# EAGLE design LilyMini_Protosnap (EAGLE 7.4.0)
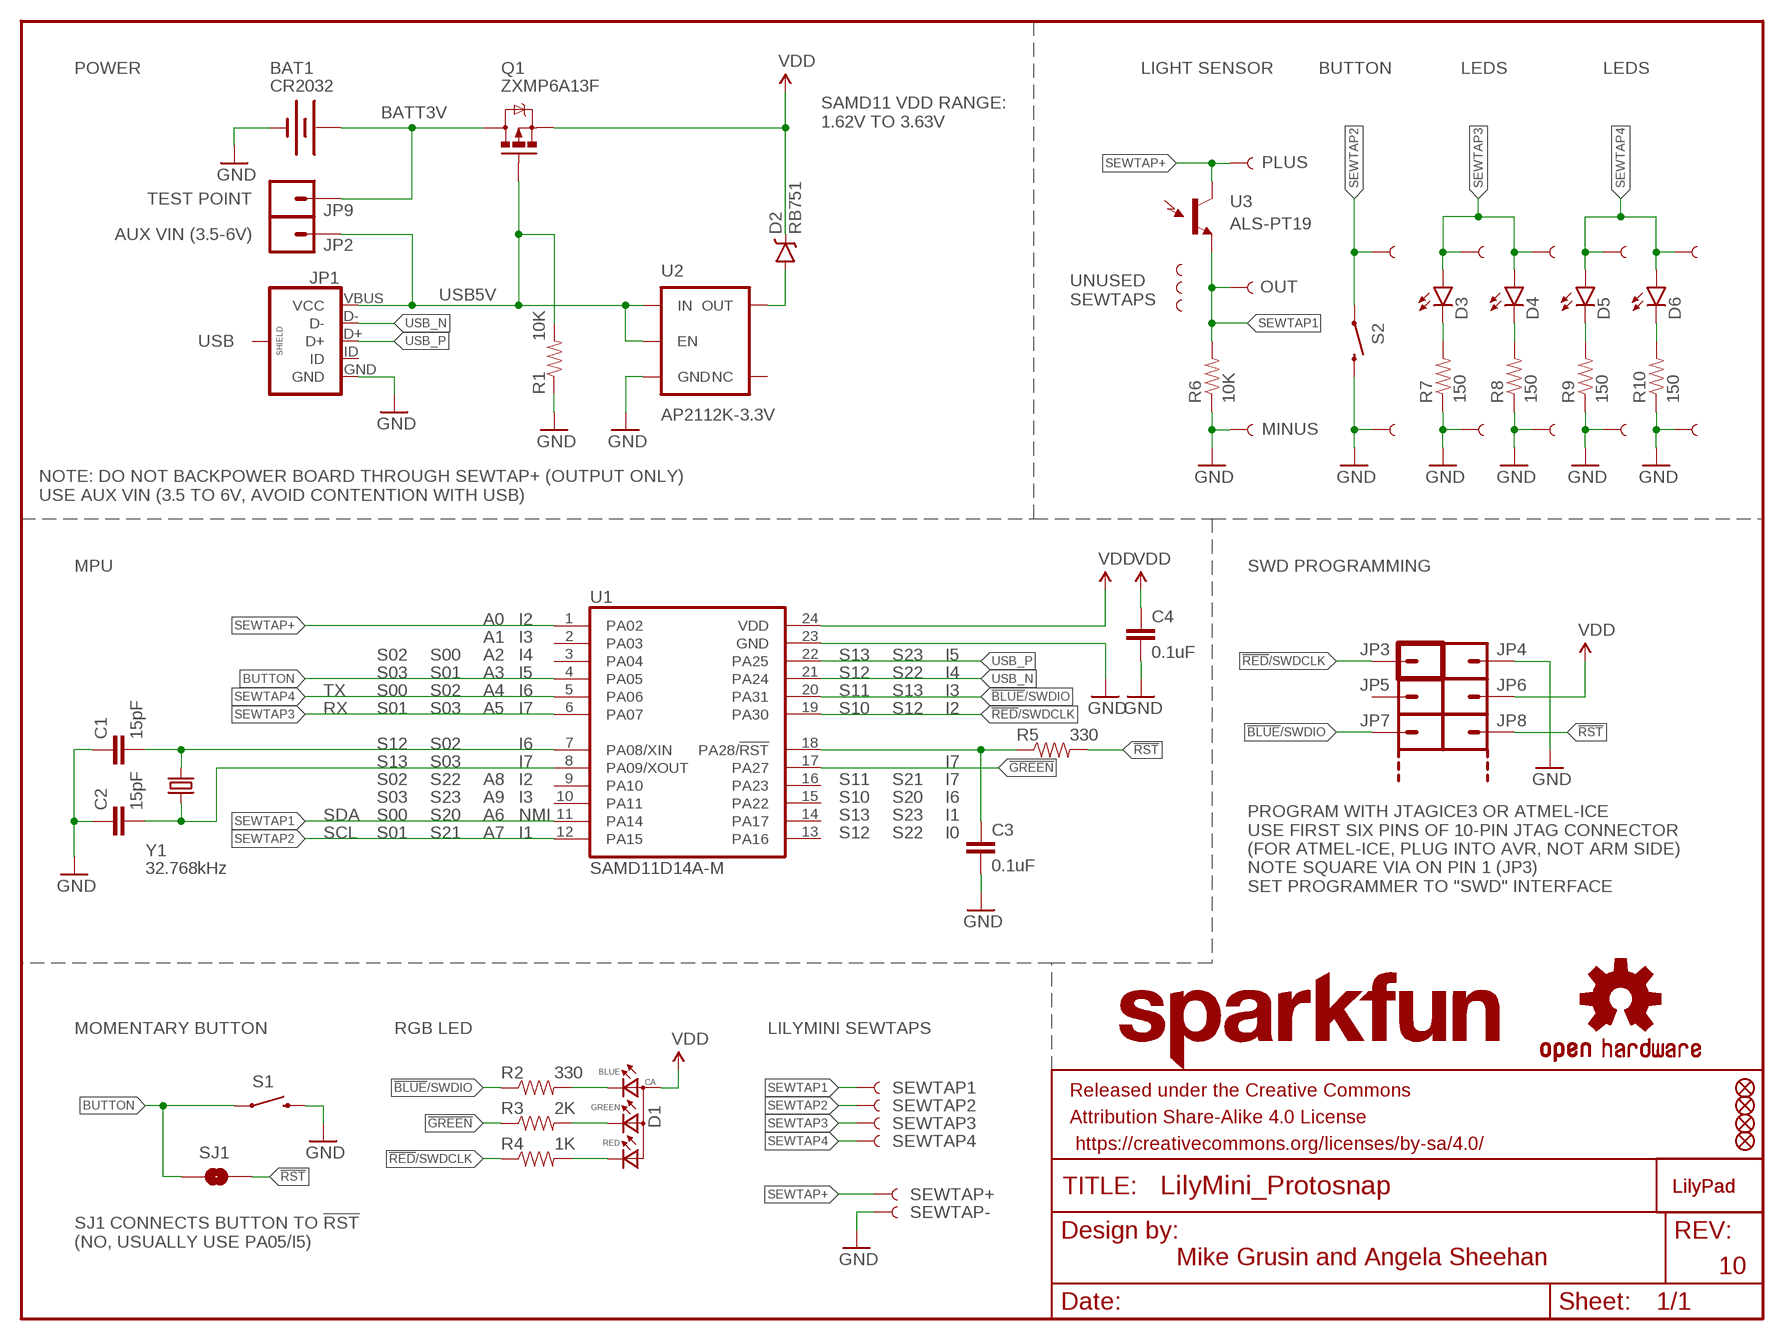
[diagram p0: schematic, sheet 1]

## Parts
$1_61_$_2016-09-25_21-56-09  OSHW-LOGOS  [OSHW-LOGO-S]
BAT1  CR2032  BATTERY20MM_PTH_KIT  [BATTERY_20MM_PTH_KIT]
C1  15pF  15PF-50V-5%(0603)  [0603-CAP]
C2  15pF  15PF-50V-5%(0603)  [0603-CAP]
C3  0.1uF  0.1UF-25V(+80/-20%)(0603)  [0603-CAP]
C4  0.1uF  0.1UF-25V(+80/-20%)(0603)  [0603-CAP]
D1  0.13_RGB_LEDPLCC  [P-LCC-4-3]
D2  RB751  DIODE-SCHOTTKY-RB751  [SOD-523]
D3  LED-WHITE1206  [LED-1206]
D4  LED-WHITE1206  [LED-1206]
D5  LED-WHITE1206  [LED-1206]
D6  LED-WHITE1206  [LED-1206]
FD1  FIDUCIAL1X2  [FIDUCIAL-1X2]
FD2  FIDUCIAL1X2  [FIDUCIAL-1X2]
FD3  FIDUCIAL1X2  [FIDUCIAL-1X2]
FD4  FIDUCIAL1X2  [FIDUCIAL-1X2]
FRAME1  FRAME-LETTER  [CREATIVE_COMMONS]
JP1  USB_MICROB_PLUGUSB-B-MICRO-SMD-VERT  [USB-B-MICRO-SMD_VERT]
JP2  M01SMDNS  [1X01NS]
JP3  M01_POGOPAD_20M_NS_1S_SQUARE  [1X01_POGOPIN_PAD_NOSILK_1SIDE_SQUARE]
JP4  M01_POGOPAD_20M_NS_1S_ROUND  [1X01_POGOPIN_PAD_NOSILK_1SIDE_ROUND]
JP5  M01_POGOPAD_20M_NS_1S_ROUND  [1X01_POGOPIN_PAD_NOSILK_1SIDE_ROUND]
JP6  M01_POGOPAD_20M_NS_1S_ROUND  [1X01_POGOPIN_PAD_NOSILK_1SIDE_ROUND]
JP7  M01_POGOPAD_20M_NS_1S_ROUND  [1X01_POGOPIN_PAD_NOSILK_1SIDE_ROUND]
JP8  M01_POGOPAD_20M_NS_1S_ROUND  [1X01_POGOPIN_PAD_NOSILK_1SIDE_ROUND]
JP9  M01_POGOPAD_20M_NS_1S_ROUND  [1X01_POGOPIN_PAD_NOSILK_1SIDE_ROUND]
JP12  SEWTAP8  [PETAL-MEDIUM-2SIDE]
JP13  SEWTAP8  [PETAL-MEDIUM-2SIDE]
JP20  SEWTAP6  [PETAL-SMALL-2SIDE]
JP21  SEWTAP6  [PETAL-SMALL-2SIDE]
JP22  SEWTAP6  [PETAL-SMALL-2SIDE]
JP23  SEWTAP6  [PETAL-SMALL-2SIDE]
JP24  SEWTAP6  [PETAL-SMALL-2SIDE]
JP25  SEWTAP6  [PETAL-SMALL-2SIDE]
JP26  SEWTAP6  [PETAL-SMALL-2SIDE]
JP27  SEWTAP6  [PETAL-SMALL-2SIDE]
LOGO1  LOGO-LPL  [LOGO-L]
LOGO2  LILYLOGO-L-TOP  [LOGO-L-TOP]
LOGO4  SFE_LOGO_NAME.1_INCH  [SFE_LOGO_NAME_.1]
Q1  ZXMP6A13F  MOSFET-PCHANNEL  [SOT23-3]
R1  10K  10KOHM-1/10W-1%(0603)0603  [0603-RES]
R2  330  330OHM1/10W1%(0603)  [0603-RES]
R3  2K  2.0KOHM1/10W5%(0603)  [0603-RES]
R4  1K  1KOHM-1/10W-1%(0603)  [0603-RES]
R5  330  330OHM1/10W1%(0603)  [0603-RES]
R6  10K  10KOHM-1/10W-1%(0603)0603  [0603-RES]
R7  150  RESISTOR0603  [0603-RES]
R8  150  RESISTOR0603  [0603-RES]
R9  150  RESISTOR0603  [0603-RES]
R10  150  RESISTOR0603  [0603-RES]
S1  SWITCH-MOMENTARY-2SMD-4.6X2.8MM  [TACTILE_SWITCH_SMD_4.6X2.8MM]
S2  SWITCH-MOMENTARY-2SMD-REDUNDANT  [TACTILE-SWITCH-SMD]
SEWTAP1  SEWTAP8  [PETAL-MEDIUM-2SIDE]
SEWTAP2  SEWTAP8  [PETAL-MEDIUM-2SIDE]
SEWTAP3  SEWTAP8  [PETAL-MEDIUM-2SIDE]
SEWTAP4  SEWTAP8  [PETAL-MEDIUM-2SIDE]
SEWTAP+  SEWTAP8  [PETAL-MEDIUM-2SIDE]
SEWTAP-  SEWTAP8  [PETAL-MEDIUM-2SIDE]
SEWTAPLS+  PLUS  SEWTAP6  [PETAL-SMALL-2SIDE]
SEWTAPLS-  MINUS  SEWTAP6  [PETAL-SMALL-2SIDE]
SEWTAPLSOUT  OUT  SEWTAP6  [PETAL-SMALL-2SIDE]
SJ1  JUMPER-PAD-2-NO  [PAD-JUMPER-2-NO_NO_SILK]
ST1  SEWTAP-NOHOLE2  [PETAL-NOHOLE-2SIDE]
ST2  SEWTAP-NOHOLE2  [PETAL-NOHOLE-2SIDE]
ST3  SEWTAP-NOHOLE2  [PETAL-NOHOLE-2SIDE]
U1  SAMD11D14A-M  [QFN-24_ALT2]
U2  AP2112K-3.3V  V_REG_AP2112K-3.3V  [SOT23-5]
U3  ALS-PT19  LIGHTSENSORALS  [ALS-PT19]
Y1  32.768kHz  CRYSTAL3.2X1.5MM  [CRYSTAL-SMD-3.2X1.5MM]

## Nets
!BLUE!/SWDIO: JP7.P$1 R2.1 U1.20(PA31)
!GREEN!: R3.1 U1.17(PA27)
!RED!/SWDCLK: JP3.P$1 R4.1 U1.19(PA30)
!RST!: JP8.P$1 R5.2 SJ1.2
!RST!1: C3.1 R5.1 U1.18(PA28/!RST!)
B: D1.3(BLUE) R2.2
BATT3V: BAT1.+1(+) BAT1.+2(+) JP9.P$1 Q1.3(D)
BUTTON: S1.1 S1.2 SJ1.1 U1.4(PA05)
G: D1.2(GREEN) R3.2
GND: BAT1.-3(-) C1.1 C2.1 C3.2 C4.2 JP1.GND JP4.P$1 JP13.1 JP21.1 JP23.1 JP25.1 JP27.1 R1.1 R6.1 R7.1 R8.1 R9.1 R10.1 S1.3 S1.4 S2.3 S2.4 SEWTAP-.1 SEWTAPLS-.1 U1.23(GND) U2.2(GND)
N$1: D2.A U2.5(OUT)
N$2: D3.C R7.2
N$3: D4.C R8.2
N$4: D5.C R9.2
N$5: D6.C R10.2
R: D1.1(RED) R4.2
SEWTAP1: R6.2 SEWTAP1.1 SEWTAPLSOUT.1 U1.11(PA14) U3.E(E1)
SEWTAP2: JP12.1 S2.1 S2.2 SEWTAP2.1 U1.12(PA15)
SEWTAP3: D3.A D4.A JP20.1 JP22.1 SEWTAP3.1 U1.6(PA07)
SEWTAP4: D5.A D6.A JP24.1 JP26.1 SEWTAP4.1 U1.5(PA06)
SEWTAP+: SEWTAP+.1 SEWTAPLS+.1 U1.1(PA02) U3.C(C1)
USB5V: JP1.VBUS(VCC) JP2.1 Q1.1(G) R1.2 U2.1(IN) U2.3(EN)
USB_N [USB]: JP1.D- U1.21(PA24)
USB_P [USB]: JP1.D+ U1.22(PA25)
VDD: C4.1 D1.4(ANODE) D2.C JP6.P$1 Q1.2(S) U1.24(VDD)
X1: C1.2 U1.7(PA08/XIN) Y1.P$2
X2: C2.2 U1.8(PA09/XOUT) Y1.P$1
Unconnected: JP1.ID JP1.P1(SHIELD) JP1.P2(SHIELD) JP1.P3(SHIELD) JP5.P$1 U1.2(PA03) U1.3(PA04) U1.9(PA10) U1.10(PA11) U1.13(PA16) U1.14(PA17) U1.15(PA22) U1.16(PA23) U2.4(NC)

## Notes on the sheet
- POWER | LIGHT SENSOR | BUTTON | LEDS | LEDS
- SAMD11 VDD RANGE:
  1.62V TO 3.63V
- TEST POINT
- AUX VIN (3.5-6V)
- UNUSED
  SEWTAPS
- USB
- NOTE: DO NOT BACKPOWER BOARD THROUGH SEWTAP+ (OUTPUT ONLY)
  USE AUX VIN (3.5 TO 6V, AVOID CONTENTION WITH USB)
- MPU | SWD PROGRAMMING
- A0 | I2
- A1 | I3
- S02 | S00 | A2 | I4 | S13 | S23 | I5
- S03 | S01 | A3 | I5 | S12 | S22 | I4
- TX | S00 | S02 | A4 | I6 | S11 | S13 | I3
- RX | S01 | S03 | A5 | I7 | S10 | S12 | I2
- S12 | S02 | I6
- S13 | S03 | I7 | I7
- S02 | S22 | A8 | I2 | S11 | S21 | I7
- S03 | S23 | A9 | I3 | S10 | S20 | I6
- SDA | S00 | S20 | A6 | NMI | S13 | S23 | I1
- SCL | S01 | S21 | A7 | I1 | S12 | S22 | I0
- PROGRAM WITH JTAGICE3 OR ATMEL-ICE
  USE FIRST SIX PINS OF 10-PIN JTAG CONNECTOR
  (FOR ATMEL-ICE, PLUG INTO AVR, NOT ARM SIDE)
  NOTE SQUARE VIA ON PIN 1 (JP3)
  SET PROGRAMMER TO "SWD" INTERFACE
- MOMENTARY BUTTON | RGB LED | LILYMINI SEWTAPS
- SJ1 CONNECTS BUTTON TO !RST!
  (NO, USUALLY USE PA05/I5)
- Mike Grusin and Angela Sheehan
- 10

## Library data of the parts
$1_61_$_2016-09-25_21-56-09 = SparkFun-Aesthetics:OSHW-LOGO: Open Source Hardware Logo This logo indicates the piece of hardware it is found on incorporates a OSHW license and/or adheres to the definition of open source hardware found here: http://freedomdefined.org/OSHW
BAT1 = mike-temp:BATTERY: Battery Holders Various common sizes : AA, AAA, 18650 (PRT-12895), 20mm coin cell and 12mm coin cell. 20MM_4LEGS, BATT-10373; PROD_ID: BATT-11519
C1 C2 = SparkFun-Capacitors:15PF-50V-5%(0603): CAP-07881; PROD_ID: CAP-07881
C3 C4 = SparkFun-Capacitors:0.1UF-25V(+80/-20%)(0603): CAP-00810 Ceramic Standard decoupling cap; PROD_ID: CAP-00810
D1 = SparkFun-LED:0.13_RGB_LED: Everlight Red/Green/Blue LED 67-23/R6GHBHC-B01/2T || 67-23/R6GHBH-B01 Size 3.2*2.8*1.9mm Mounting Type SMD Full-Color LED PLCC4 Emitting Color Red/Green/Blue (620-625/530-535/470-475 nm) Chip Material AlGaInP/InGaN/InGaN Luminous Intensity 57-112/225-450/36-72 mcd Viewing Angle 120 deg Lens Type-Color Water Clear Forward Voltage 2.0/3.5/3.5 V Forward Current 10 mA Maximum Forward Voltage 2.4/3.9/3.9 V Maximum Forward Current 25/25/25 mA Min-Max Operating Temperature -40C to +85C Factory Pack 2000 pcs-Reel RoHS ✓; PROD_ID: DIO-12986
D2 = SparkFun-DiscreteSemi:DIODE-SCHOTTKY: Schottky diodes in SFE's production catalog BAT20J 1A 23V 0.62Vf RB751 120mA 40V 0.37Vf PMEG4005EJ 0.5A 40V 0.42Vf MBRA140 1A 40V 0.5Vf B340A 3A 40V SMA; PROD_ID: DIO-11018
D3-D6 = SparkFun-LED:LED-WHITE: White SMD LEDs LilyPad 1206- DIO-09955; PROD_ID: DIO-09955; VALUE: WHITE
FD1-FD4 = SparkFun-Aesthetics:FIDUCIAL: Fiducial Alignment Points Various fiducial points for machine vision alignment.
FRAME1 = SparkFun-Aesthetics:FRAME-LETTER: Schematic Frame Standard 8.5x11 US Letter frame
JP1 = mike-temp:USB_MICROB_PLUG: USB Micro-B connectors Some male, some female. Watch your step!
JP2 = SparkFun-Connectors:M01: Header 1
JP3-JP9 = mike-temp:M01: Header 1
JP12 JP13 JP20-JP27 SEWTAP1-SEWTAP4 SEWTAP+ SEWTAP- SEWTAPLS+ SEWTAPLS- SEWTAPLSOUT = LilyPad-Wearables:SEWTAP: Sew Taps for LilyPad Boards.
LOGO1 = LilyPad-Wearables:LOGO-LP
LOGO2 = mike-temp:LILYLOGO-L-TOP
LOGO4 = SparkFun-Aesthetics:SFE_LOGO_NAME: SFE Logo, name only This is the SparkFun name logo. The logo on the schematic will always be the same size; the package variant is the height of the flame part of the logo (or the height the flame would be, if it were drawn). Default layer for the logo on the board is tSilk.
Q1 = SparkFun-DiscreteSemi:MOSFET-PCHANNEL: Generic PMOSFET IRLML2244 - TRANS-11153 (SOT-23 -20V -4.3A) (1.Gate 2.Source 3.Drain) FQP27P06 - COM-10349 <http://www.sparkfun.com/products/10349> (TO-220 -60V -27A) (1.Gate 2.Source 3.Drain); PROD_ID: TRANS-08285
R1 R6 = SparkFun-Resistors:10KOHM-1/10W-1%(0603): RES-00824; PROD_ID: RES-00824
R2 R5 = SparkFun-Resistors:330OHM1/10W1%(0603): RES-00818; PROD_ID: RES-00818
R3 = SparkFun-Resistors:2.0KOHM1/10W5%(0603): RES-08296; PROD_ID: RES-08296; VALUE: 2.0k
R4 = SparkFun-Resistors:1KOHM-1/10W-1%(0603): RES-07856; PROD_ID: RES-07856
R7-R10 = SparkFun-Resistors:RESISTOR: Resistor Basic schematic elements and footprints for 0603, 1206, and PTH resistors.
S1 = SparkFun-Electromechanical:SWITCH-MOMENTARY-2: Various NO switches- pushbuttons, reed, etc; PROD_ID: SWCH-13065
S2 = SparkFun-Electromechanical:SWITCH-MOMENTARY-2: Various NO switches- pushbuttons, reed, etc; PROD_ID: SWCH-08247
SJ1 = SparkFun-Passives:JUMPER-PAD-2-NO
ST1-ST3 = LilyPad-Wearables:SEWTAP-NOHOLE
U1 = mike-temp:SAMD11D14A-M
U2 = SparkFun-PowerIC:V_REG_AP2112: AP2112 - 600mA CMOS LDO Regulator w/ Enable The AP2112 is CMOS process low dropout linear regulator with enable function, the regulator delivers a guaranteed 600mA (min.) continuous load current. Features Output Voltage Accuracy: ±1.5% Output Current: 600mA (Min.) Foldback Short Current Protection: 50mA Enable Function to Turn ON/OFF VOUT Low Dropout Voltage (3.3V): 250mV (Typ.) @IOUT=600mA Excellent Load Regulation: 0.2%/A (Typ.) Excellent Line Regulation: 0.02%/V (Typ.) Low Quiescent Current: 55μA (Typ.) Low Standby Current: 0.01μA (Typ.) Low Output Noise: 50μVRMS PSRR: 100Hz -65dB, 1kHz -65dB OTSD Protection Stable with 1.0μF Flexible Cap: Ceramic, Tantalum and Aluminum Electrolytic Operation Temperature Range: -40°C to 85°C ESD: MM 400V, HBM 4000V; PROD_ID: VREG-12457; VALUE: 3.3V
U3 = SparkFun-Sensors:LIGHTSENSOR: Ambient Light Sensor Simple light detection sensor. Output varies with light intensity input. Spark Fun Electronics SKU : COM-08348; PROD_ID: IC-11836
Y1 = SparkFun-FreqCtrl:CRYSTAL: Various standard crystals. Proven footprints.; PROD_ID: XTAL-13062

## Net classes
1 USB: width 0.305 mm, drill 0.508 mm, clearance 0.195 mm

## Board
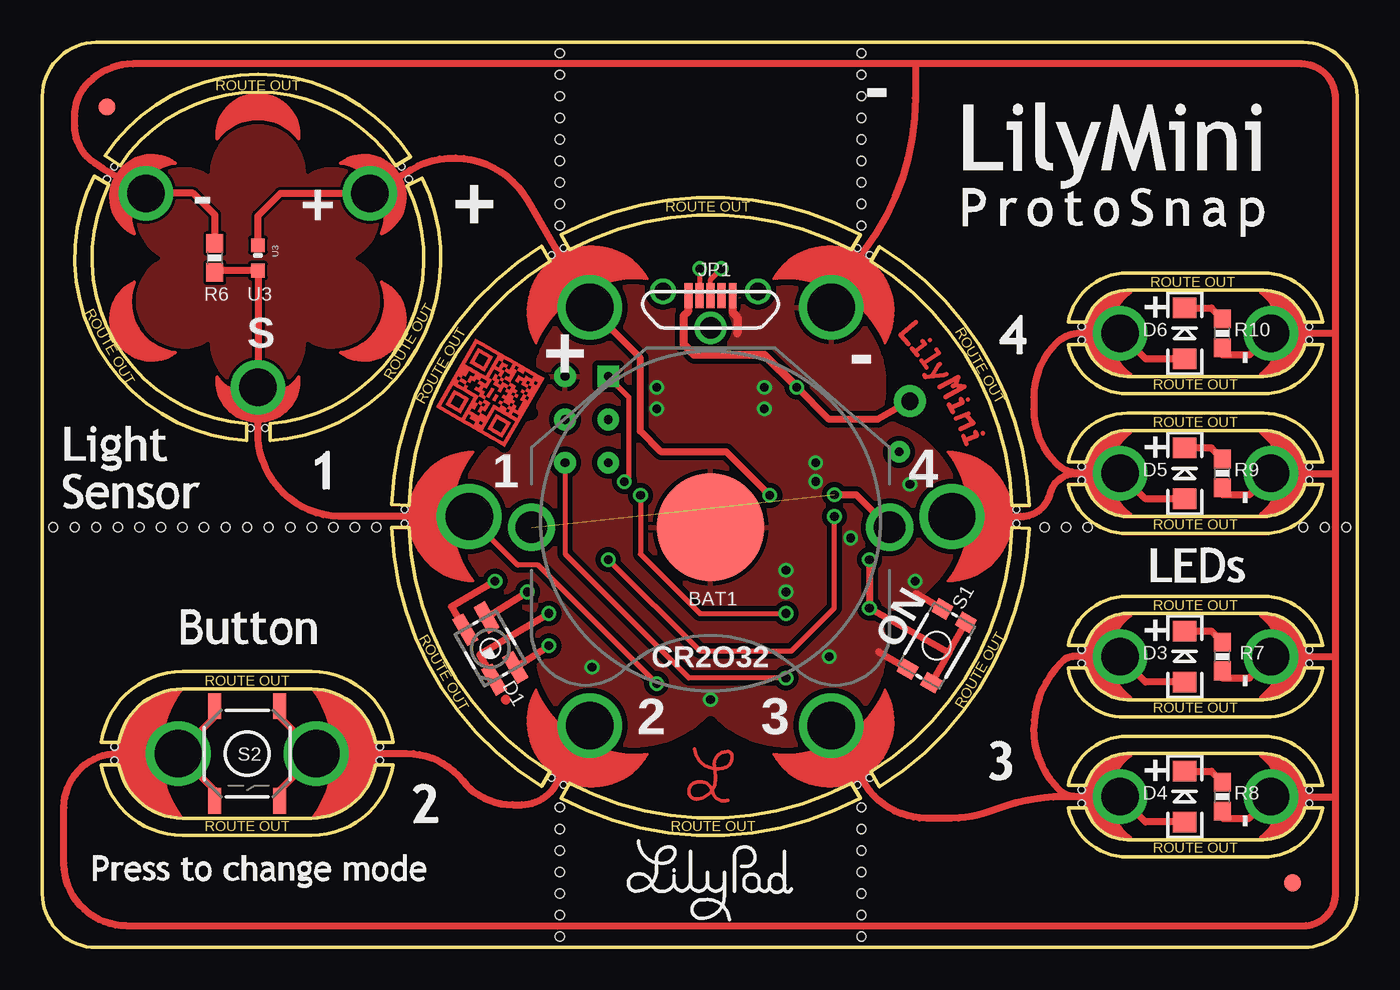
[diagram p1: board, top side]
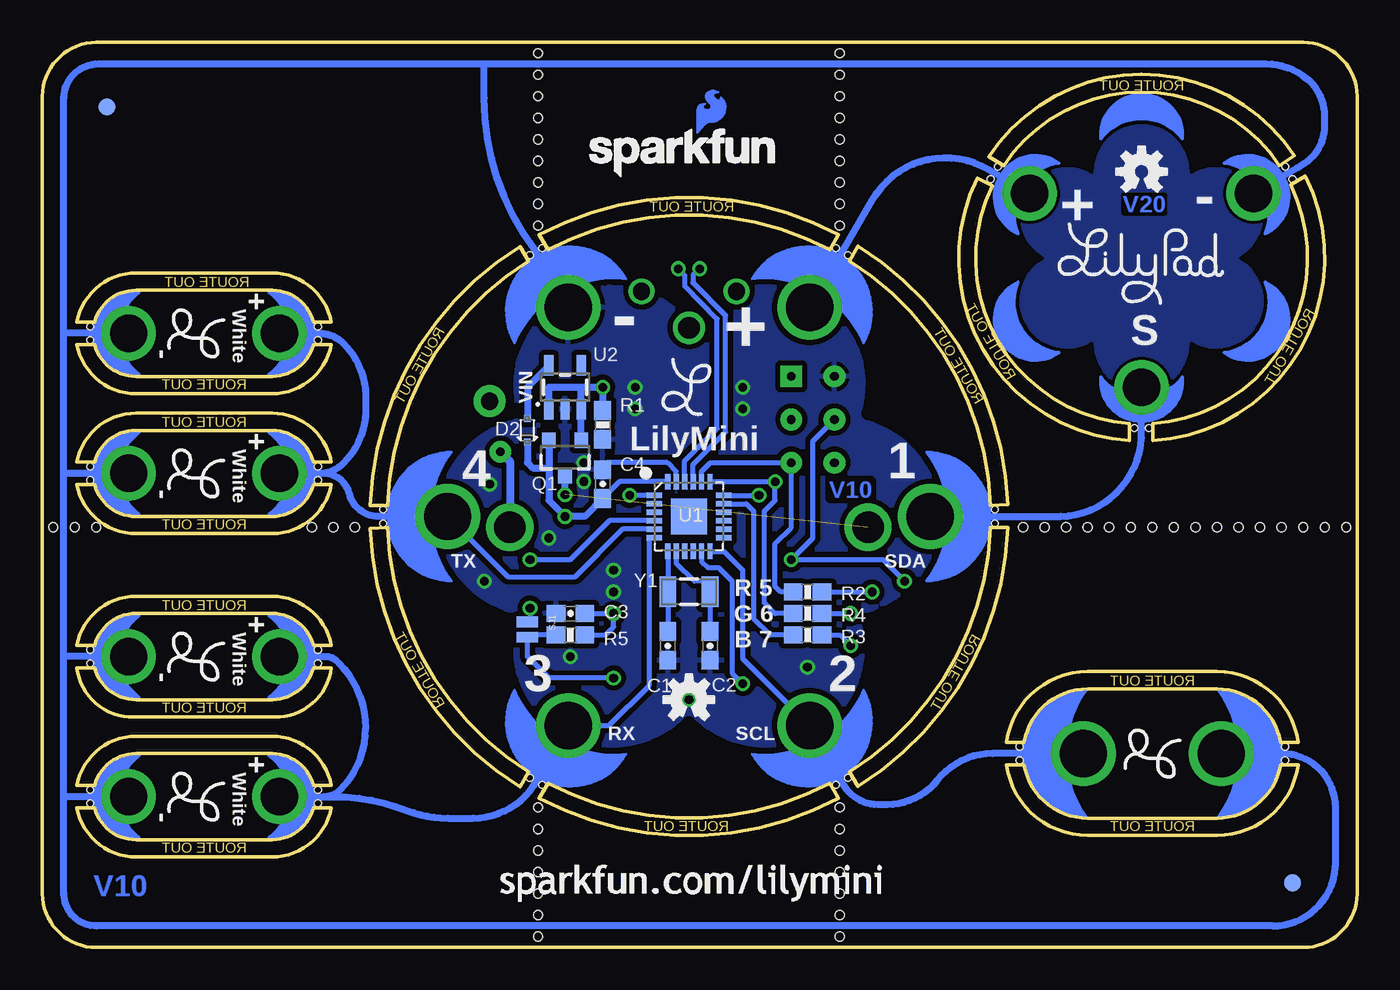
[diagram p2: board, bottom side, seen from below]

Size 77.47 x 53.34 mm. Coordinates in mm from the lower left corner, seen from the top.
Outline: 74.3,0 3.17,0 arc-90 0,3.17 0,50.16 arc-90 3.17,53.34 74.3,53.34 arc-90 77.47,50.16 77.47,3.17 arc-90 74.3,0
Outline: 13.41,30.89 13.41,29.87 arc112 22.38,45.34 21.5,44.9 arc-112 13.41,30.89
Outline: 20.82,46.09 21.7,46.6 arc113 3.7,46.66 4.58,46.09 arc-112 20.82,46.09
Outline: 3.92,44.95 3.04,45.45 arc113 12.04,29.87 12.04,30.88 arc-112 3.92,44.95
Outline: 57.14,26.06 58.15,26.06 arc56 49.33,41.32 48.83,40.46 arc-56 57.14,26.06
Outline: 47.68,41.12 48.19,42 arc56 30.55,42.02 31.06,41.12 arc-56 47.68,41.12
Outline: 29.91,40.46 29.41,41.34 arc56 20.59,26.1 21.6,26.06 arc-56 29.91,40.46
Outline: 21.6,24.74 20.59,24.74 arc56 29.41,9.48 29.91,10.34 arc-56 21.6,24.74
Outline: 31.06,9.68 30.55,8.8 arc56 48.19,8.78 47.68,9.68 arc-56 31.06,9.68
Outline: 48.83,10.34 49.33,9.46 arc56 58.15,24.7 57.14,24.74 arc-56 48.83,10.34
Outline: 4.5,12.09 arc-80 8.26,15.24 15.88,15.24 arc-80 19.63,12.09 20.66,12.09 arc82 15.88,16.26 8.26,16.26 arc82 3.47,12.09 4.5,12.09
Outline: 4.5,10.77 arc80 8.26,7.62 15.88,7.62 arc80 19.63,10.77 20.66,10.77 arc-82 15.88,6.6 8.26,6.6 arc-82 3.47,10.77 4.5,10.77
Outline: 61.49,35.53 arc75 63.94,33.66 71.94,33.66 arc75 74.4,35.53 75.44,35.53 arc-79 71.94,32.64 63.94,32.64 arc-79 60.45,35.53 61.49,35.53
Outline: 61.49,36.85 arc-75 63.94,38.73 71.94,38.73 arc-75 74.4,36.85 75.44,36.85 arc79 71.94,39.75 63.94,39.75 arc79 60.45,36.85 61.49,36.85
Outline: 61.49,27.28 arc75 63.94,25.4 71.94,25.4 arc75 74.4,27.28 75.44,27.28 arc-79 71.94,24.38 63.94,24.38 arc-79 60.45,27.28 61.49,27.28
Outline: 61.49,28.6 arc-75 63.94,30.48 71.94,30.48 arc-75 74.4,28.6 75.44,28.6 arc79 71.94,31.5 63.94,31.5 arc79 60.45,28.6 61.49,28.6
Outline: 61.49,16.48 arc75 63.94,14.61 71.94,14.61 arc75 74.4,16.48 75.44,16.48 arc-79 72.39,13.59 63.5,13.59 arc-79 60.45,16.48 61.49,16.48
Outline: 61.49,17.8 arc-75 63.94,19.68 71.94,19.68 arc-75 74.4,17.8 75.44,17.8 arc79 71.94,20.7 63.94,20.7 arc79 60.45,17.8 61.49,17.8
Outline: 61.49,8.23 arc75 63.94,6.35 71.94,6.35 arc75 74.4,8.23 75.44,8.23 arc-79 71.94,5.33 63.94,5.33 arc-79 60.45,8.23 61.49,8.23
Outline: 61.49,9.55 arc-75 63.94,11.43 71.94,11.43 arc-75 74.4,9.55 75.44,9.55 arc79 71.94,12.45 63.94,12.45 arc79 60.45,9.55 61.49,9.55
Copper layers (1*16): Top 0.035mm / dielectric 1.5mm / Bottom 0.035mm
Design rules "SparkFun-2-layer-TIGHT *": minimum track width 7mil, minimum drill 15mil, track to track 7mil, track to pad 7mil, pad to pad 7mil, via to via 7mil, smd to smd 7mil, copper to edge 7mil, drill to drill 7mil, minimum pad ring 7mil, minimum via ring 7mil, stop-mask expansion 4mil, vias tented up to drill 25mil, thermal gap 10mil
Holes 0.38 mm at 13.12,30.62 12.28,30.62 21.17,46.02 21.59,45.28 3.81,45.28 4.23,46.02 57.4,25.82 57.4,24.98 48.02,41.22 48.74,40.81 30,40.81 30.72,41.22 21.34,24.98 21.34,25.82 30.72,9.58 30,9.99 48.74,9.99 48.02,9.58 4.25,11.02 4.25,11.84 19.88,11.02 19.88,11.84 61.24,35.79 61.24,36.6 74.65,35.79 74.65,36.6 61.24,27.53 61.24,28.35 74.65,27.53 74.65,28.35 61.24,16.74 61.24,17.55 74.65,16.74 74.65,17.55 61.24,8.48 61.24,9.3 74.65,8.48 74.65,9.3
Holes 0.51 mm at 19.68,24.77 18.41,24.77 17.14,24.77 15.88,24.77 14.61,24.77 13.34,24.77 12.06,24.77 10.79,24.77 9.53,24.77 8.26,24.77 6.99,24.77 5.71,24.77 4.45,24.77 3.17,24.77 1.91,24.77 0.64,24.77 59.05,24.77 60.33,24.77 61.59,24.77 74.3,24.77 75.56,24.77 76.83,24.77 30.48,8.26 30.48,6.99 30.48,5.71 30.48,4.45 30.48,3.17 30.48,1.91 30.48,0.64 48.26,8.26 48.26,6.99 48.26,5.71 48.26,4.45 48.26,3.17 48.26,1.91 48.26,0.64 30.48,42.55 30.48,43.81 30.48,45.09 30.48,46.35 30.48,47.62 30.48,48.9 30.48,50.16 30.48,51.44 30.48,52.7 48.26,42.55 48.26,43.81 48.26,45.09 48.26,46.35 48.26,47.62 48.26,48.9 48.26,50.16 48.26,51.44 48.26,52.7
tRestrict: area 21,16.1 to 28.8,34.7; area 23.2,6.8 to 39.4,19.3; area 39.4,6.8 to 55.6,19.3; area 49.9,16.1 to 57.8,34.7; area 23.4,29.6 to 29.5,35.7; area 7.4,30.5 to 18,35.6; area 15.6,31.5 to 23,40.6; area 15.6,40.6 to 23,49.8; area 7.4,45.7 to 17.7,50.8; area 2,40.6 to 9.8,49.8; area 2,31.5 to 9.8,40.6; area 39.4,31.5 to 55.6,44; area 23.2,31.6 to 39.4,44
bRestrict: area 49.9,16.1 to 57.8,34.7; area 39.4,6.8 to 55.6,19.3; area 23.2,6.8 to 39.4,19.3; area 21,16.1 to 28.8,34.7; area 40,27.6 to 43.8,28.7; area 7.4,30.5 to 18,35.6; area 15.6,31.5 to 23,40.6; area 15.6,40.6 to 23,49.8; area 7.4,45.7 to 17.7,50.8; area 2,40.6 to 9.8,49.8; area 2,31.5 to 9.8,40.6; area 39.4,31.5 to 55.6,44; area 23.2,31.6 to 39.3,44.1

### Footprints (pad centres in the part's own frame; a part is rotated, then mirrored left to right if it is on the bottom)
BATTERY_20MM_PTH_KIT = drill 1.854: +1 -10.554,0; +2 10.554,0 | smd 6.35 x 6.35: -3 0,0
0603-CAP = smd 1.1 x 1: 1 -0.85,0; 2 0.85,0
P-LCC-4-3 = smd 0.75 x 1.8: 1 0.725,1.7; 2 -0.725,1.7; 3 -0.725,-1.7; 4 0.725,-1.7
SOD-523 = smd 0.4 x 0.4: A -0.7,0; C 0.7,0
LED-1206 = smd 1.2 x 1.4: A -1.5,0; C 1.5,0
FIDUCIAL-1X2 = smd 1 x 1: 1 0,0
USB-B-MICRO-SMD_VERT = smd 0.45 x 1.5: D+ 0,0; D- -0.65,0; GND 1.3,0; ID 0.65,0; VBUS -1.3,0 | drill 1.016: P1 -2.8,0.25; P2 2.8,0.25 | drill 1.27: P3 0,-1.9
1X01NS = drill 1.016 pad 1.88: 1 0,0
1X01_POGOPIN_PAD_NOSILK_1SIDE_SQUARE = drill 0.508 pad 1.27 square: P$1 0,0
1X01_POGOPIN_PAD_NOSILK_1SIDE_ROUND = drill 0.508 pad 1.27: P$1 0,0
PETAL-MEDIUM-2SIDE = drill 2.794: 1 0,-0.254
PETAL-SMALL-2SIDE = drill 2.2: 1 0,0
SOT23-3 = smd 0.8 x 0.9: 1 -0.95,-1; 2 0.95,-1; 3 0,1.1
0603-RES = smd 1.1 x 1: 1 -0.85,0; 2 0.85,0
TACTILE_SWITCH_SMD_4.6X2.8MM = smd 0.9 x 1: 1 -2.05,-0.8; 2 2.05,-0.8; 3 2.05,0.8; 4 -2.05,0.8
TACTILE-SWITCH-SMD = smd 1.524 x 0.762: 1 -2.794,1.905; 2 2.794,1.905; 3 -2.794,-1.905; 4 2.794,-1.905
PAD-JUMPER-2-NO_NO_SILK = smd 0.635 x 1.27: 1 -0.45,0; 2 0.45,0
QFN-24_ALT2 = smd 0.9 x 0.3: 1 -2.05,1.25; 2 -2.05,0.75; 3 -2.05,0.25; 4 -2.05,-0.25; 5 -2.05,-0.75; 6 -2.05,-1.25; 13 2.05,-1.25; 14 2.05,-0.75; 15 2.05,-0.25; 16 2.05,0.25; 17 2.05,0.75; 18 2.05,1.25 | smd 0.3 x 0.9: 7 -1.25,-2.05; 8 -0.75,-2.05; 9 -0.25,-2.05; 10 0.25,-2.05; 11 0.75,-2.05; 12 1.25,-2.05; 19 1.25,2.05; 20 0.75,2.05; 21 0.25,2.05; 22 -0.25,2.05; 23 -0.75,2.05; 24 -1.25,2.05 | smd 2.1 x 2.1: EP 0,0
SOT23-5 = smd 0.55 x 1.2: 1 -0.95,-1.3; 2 0,-1.3; 3 0.95,-1.3; 4 0.95,1.3; 5 -0.95,1.3
ALS-PT19 = smd 0.8 x 0.8: C -0.75,0; E 0.75,0
CRYSTAL-SMD-3.2X1.5MM = smd 1 x 1.8: P$1 -1.25,0; P$2 1.25,0

### Placement (x,y rotation side)
$1_61_$_2016-09-25_21-56-09  39.37,14.61 0 bottom
BAT1  39.37,24.77 180 top
C1  40.62,17.78 90 bottom
C2  38.12,17.78 90 bottom
C3  46.35,19.68 180 bottom
C4  44.45,27.3 90 bottom
D1  26.4,17.62 210 top
D2  48.9,30.48 270 bottom
D3  67.31,17.14 90 top
D4  67.31,8.89 90 top
D5  67.31,27.94 90 top
D6  67.31,36.2 90 top
FD1  3.81,49.53 0 top
FD2  73.66,3.81 0 top
FD3  73.66,49.53 0 bottom
FD4  3.81,3.81 0 bottom
FRAME1  4.45,-17.78 0 top  (outside the outline)
JP1  39.37,38.42 0 top
JP2  51.12,32.19 0 top
JP3  33.34,33.66 0 bottom
JP4  30.8,33.66 0 bottom
JP5  33.34,31.11 0 bottom
JP6  30.8,31.11 0 bottom
JP7  33.34,28.57 0 bottom
JP8  30.8,28.57 0 bottom
JP9  50.48,29.21 0 bottom
JP12  15.88,11.43 90 top
JP13  8.26,11.43 270 top
JP20  63.5,17.14 270 top
JP21  72.39,17.14 90 top
JP22  63.5,8.89 270 top
JP23  72.39,8.89 90 top
JP24  63.5,36.2 270 top
JP25  72.39,27.94 90 top
JP26  63.5,27.94 270 top
JP27  72.39,36.2 90 top
LOGO1  39.53,33.02 0 bottom
LOGO2  39.37,10.16 6 top
LOGO3  OSHW-LOGOS  [OSHW-LOGO-S]  12.7,45.72 0 bottom
LOGO4  45.72,44.93 0 bottom
Q1  46.67,28.89 180 bottom
R1  44.45,30.8 90 bottom
R2  32.38,20.95 0 bottom
R3  32.38,18.41 0 bottom
R4  32.38,19.68 0 bottom
R5  46.35,18.41 180 bottom
R6  10.16,40.64 270 top
R7  69.53,17.14 90 top
R8  69.53,8.89 90 top
R9  69.53,27.94 90 top
R10  69.53,36.2 90 top
S1  52.7,17.78 60 top
S2  12.06,11.43 270 top
SEWTAP1  25.4,25.4 270 top
SEWTAP2  32.38,13.3 330 top
SEWTAP3  46.35,13.3 30 top
SEWTAP4  53.34,25.4 90 top
SEWTAP+  32.38,37.5 210 top
SEWTAP-  46.35,37.5 150 top
SEWTAPLS+  19.3,44.45 120 top
SEWTAPLS-  6.1,44.45 240 top
SEWTAPLSOUT  12.7,33.02 0 top
SJ1  48.9,18.73 270 bottom
ST1  12.7,48.26 180 top
ST2  6.1,36.83 300 top
ST3  19.3,36.83 60 top
U1  39.37,25.4 0 bottom
U2  46.67,33.02 0 bottom
U3  12.7,40.64 270 top
U$1  [LOGO-LILYPAD]  39.37,4.29 0 top
U$2  LOGO-LPLP  [LOGO-LILYPAD]  12.7,40.64 0 bottom
U$4  [SFE_LOGO_FLAME_COPPER_EXPOSED_.1]  39.21,47.62 0 bottom
U$5  [LOGO-L]  12.06,11.43 270 bottom
U$6  [LOGO-L]  68.42,27.94 270 bottom
U$7  [LOGO-L]  68.42,17.14 270 bottom
U$8  [LOGO-L]  68.42,8.89 270 bottom
U$9  [LOGO-L]  68.42,36.2 270 bottom
Y1  39.37,20.95 180 bottom

### Tracks (layer width: path | path; a pad name or v marks a point on that pad's centre or on a via)
!BLUE!/SWDIO
  Bottom 0.305: R2.1 33.97,20.95 34.29,21.27 34.29,23.81 33.34,24.77 JP7.P$1 38.1,28.57 38.62,28.05 U1.20
!GREEN!
  Bottom 0.305: U1.17 35.99,26.15 35.56,25.72 35.56,19.37 34.61,18.41 R3.1
!RED!/SWDCLK  (via drill 0.51)
  Top 0.305: JP3.P$1 34.54,32.45 34.54,27.7 v34.29,27.45
  Bottom 0.305: R4.1 34.29,19.68 34.92,20.32 34.92,25.72 34.29,26.35 v34.29,27.45 U1.19
!RST!  (via drill 0.51)
  Top 0.305: v43.81,15.88 38.1,15.88 30.8,23.18 JP8.P$1
  Bottom 0.305: 47.2,18.6 R5.2 48.9,18.41 SJ1.2 48.9,17.14 47.62,15.88 v43.81,15.88
!RST!1  (via drill 0.51)
  Top 0.305: v35.24,26.65 35.24,23.18 38.73,19.68 v43.81,19.68
  Bottom 0.305: U1.18 v35.24,26.65 | C3.1 v43.81,19.68 43.81,18.89 44.29,18.41 R5.1
B  (via drill 0.51)
  Top 0.406: D1.3 v28.57,20.95
  Bottom 0.305: R2.2 v28.57,20.95
BATT3V  (via drill 0.51)  (1 unrouted)
  Top 0.406: v46.67,26.68 47.95,26.68 BAT1.+1
  Bottom 0.406: v46.67,26.68 Q1.3
  Bottom 0.457: JP9.P$1 49.92,28.65 BAT1.+1
BUTTON  (via drill 0.51)
  Top 0.406: v48.74,22.86 v48.74,20 53.42,17.38 | 53.42,17.38 S1.1 | 53.42,17.38 S1.2
  Bottom 0.305: v48.74,22.86 46.35,22.86 44.06,25.15 U1.4 | v48.74,20 48.74,19.18 SJ1.1
G  (via drill 0.51)
  Top 0.406: D1.2 v29.84,17.78
  Bottom 0.305: R3.2 30.48,18.41 v29.84,17.78
GND  (via drill 0.51)
  Top 0.305: 48.26,40.77 48.44,41.09
  Top 0.406: S1.4 49.27,17.42 | S1.3 51.47,20.86 | 76.2,8.89 76.2,3.17 arc-90 74.3,1.27 4.97,1.27 arc-90 1.27,4.97 1.27,8.26 arc-90 4.45,11.43 JP13.1 | 76.2,8.89 76.2,17.14 | 76.2,17.14 76.2,27.94 | 76.2,27.94 76.2,36.2 | 76.2,36.2 76.2,50.06 arc90 74.19,52.07 51.44,52.07 | 51.44,52.07 5.34,52.07 arc45 2.73,50.99 arc45 1.91,49.01 1.91,48.42 arc57 3.1,46.22 3.54,45.94 SEWTAPLS-.1 8.89,44.45 10.16,43.18 R6.1 | R7.1 69.53,15.88 71.12,15.88 JP21.1 76.2,17.14 | R8.1 69.53,7.62 71.12,7.62 JP23.1 76.2,8.89 | 76.2,36.2 JP27.1 71.12,34.92 69.53,34.92 R10.1 | 76.2,27.94 JP25.1 71.12,26.67 69.53,26.67 R9.1 | SEWTAP-.1 48.26,40.77 | S2.3 10.16,13.59 JP13.1 | S2.4 10.16,9.27 JP13.1 | 51.44,52.07 51.44,50.08 arc-37 48.44,41.09
  Top 0.457: JP1.GND 40.67,37.44 40.96,37.15 40.96,36.2
  Bottom 0.305: U1.23 40.12,28.05 40.64,28.57 44.19,28.57 C4.2
  other vias: 42.55,31.75 51.12,27.3 45.56,28.57 45.56,27.46 43.81,20.95 39.37,14.61 36.2,31.75 46.35,17.14 51.44,21.59 47.62,24.13 32.38,16.51 42.55,33.02 36.2,33.02 43.81,22.23
  pour Top (isolate 0.305): 39.37,43.97 30.16,41.27 23.18,34.71 20.95,25.4 23.18,16.09 30.16,9.53 39.37,6.77 48.58,9.53 55.56,16.09 57.78,25.4 55.56,34.71 48.58,41.27
  pour Bottom (isolate 0.305): 39.37,43.97 48.58,41.27 55.56,34.71 57.78,25.4 55.56,16.09 48.58,9.53 39.37,6.77 30.16,9.53 23.18,16.09 20.95,25.4 23.18,34.77 30.16,41.27
GND4
  Bottom 0.406: 76.2,8.89 76.2,3.17 arc-90 74.3,1.27 4.97,1.27 arc-90 1.27,4.97 1.27,8.26 arc-90 4.45,11.43 8,11.43 | 76.2,8.89 76.2,17.14 | 76.2,17.14 76.2,27.94 | 76.2,27.94 76.2,36.2 | 76.2,36.2 76.2,50.06 arc90 74.19,52.07 51.44,52.07 | 51.44,52.07 5.34,52.07 arc45 2.73,50.99 arc45 1.91,49.01 1.91,48.42 arc57 3.1,46.22 3.54,45.94 6.1,44.45 | 72.39,36.2 76.2,36.2 | 72.39,27.94 76.2,27.94 | 72.39,17.14 76.2,17.14 | 72.39,8.89 76.2,8.89 | 46.48,37.72 48.26,40.77 48.44,41.09 arc37 51.44,50.08 51.44,52.07
N$1
  Bottom 0.406: U2.5 47.62,34.29 48.9,33.02 D2.A
N$2
  Top 0.406: D3.C 68.88,18.64 R7.2
N$3
  Top 0.406: D4.C 68.88,10.39 R8.2
N$4
  Top 0.406: R9.2 68.88,29.44 D5.C
N$5
  Top 0.406: D6.C 68.88,37.7 R10.2
N$6
  pour Top: 7.37,31.5 12.7,30.48 18.03,31.5 21.59,35.24 23.04,40.64 21.59,45.72 17.71,49.78 12.7,50.8 7.37,49.78 3.81,45.72 2.04,40.64 3.81,35.56
N$7
  pour Bottom: 7.37,31.5 12.7,30.48 18.03,31.5 21.59,35.24 23.04,40.64 21.59,45.72 17.71,49.78 12.7,50.8 7.37,49.78 3.81,45.72 2.04,40.64 3.81,35.56
N$8
  Top 0.254: 54.28,30.14 54.45,29.66
N$9
  Top 0.254: 54.41,29.92 55.07,30.16 54.99,30.39
N$10
  Top 0.254: 55.42,30.3
N$11
  Top 0.254: 54.11,30.57 54.85,30.89 54.43,31.36
N$12
  Top 0.254: 53.84,31.16 54.56,31.46
N$13
  Top 0.254: 53.65,31.55 53.43,32
N$14
  Top 0.254: 53.59,31.81 54.22,32.11 54.12,32.32
N$15
  Top 0.254: 54.55,32.28
N$16
  Top 0.254: 53.21,32.44 54.32,33.05 53.76,33.14 53.65,33.08 53.79,33.16 53.98,33.62 52.86,33.02
N$17
  Top 0.254: 51.98,33.75 52.04,33.62 53.11,33.72 53.27,33.8
N$18
  Top 0.254: 52.88,34.38 52.79,34.32 52.42,33.68
N$19
  Top 0.254: 51.8,34.59 52.08,34.19
N$20
  Top 0.254: 51.96,34.43 52.83,35.03 52.69,35.23
N$21
  Top 0.254: 51.25,35.29 51.55,34.9
N$22
  Top 0.254: 51.42,35.12 52.01,35.55 51.86,35.75
N$23
  Top 0.254: 52.3,35.8 52.3,35.79
N$24
  Top 0.254: 51.03,35.57 50.57,36.08 51.46,36.84
R  (via drill 0.51)
  Top 0.406: D1.1 25.77,17.26 v29.84,19.68
  Bottom 0.305: R4.2 v29.84,19.68
SEWTAP1  (via drill 0.51)
  Top 0.305: v36.2,15.56 29.21,22.54 28,22.54 SEWTAP1.1
  Top 0.406: R6.2 10.16,39.89 U3.E SEWTAPLSOUT.1 12.7,30.48 arc90 17.46,25.4 SEWTAP1.1
  Bottom 0.305: U1.11 38.62,22.75 38.26,22.38 37.62,22.38 36.83,21.59 36.83,16.19 v36.2,15.56
SEWTAP2
  Top 0.406: SEWTAP2.1 30.2,9.51 arc-58 28.25,8.41 27.7,8.41 arc-52 24.75,9.85 arc52 21.48,11.43 JP12.1 | S2.2 13.97,9.27 JP12.1 | S2.1 13.97,13.59 JP12.1
  Bottom 0.305: SEWTAP2.1 36.2,17.02 36.2,22.23 37.32,23.35 U1.12
SEWTAP3
  Top 0.305: 60.15,16.9 60.01,16.76
  Top 0.406: D3.A 65,15.64 JP20.1 60.75,17.14 arc45 60.15,16.9 | D4.A 65,7.39 JP22.1 60.9,8.89 | SEWTAP3.1 48.33,9.88 arc62 52.09,7.62 53.58,7.62 arc18 55.59,7.95 56.64,8.29 arc-18 60.3,8.89 60.9,8.89 | 60.9,8.89 arc-45 59.92,9.3 arc-45 58.42,12.92 arc-45 60.01,16.76
  Bottom 0.305: SEWTAP3.1 44.07,13.08 41.74,15.41 41.74,24.15 U1.6
SEWTAP4
  Top 0.305: JP26.1 61.16,27.94
  Top 0.406: D6.A 65,34.7 JP24.1 61.16,36.2 arc45 59.74,35.61 arc45 58.42,32.43 58.42,31.71 arc45 59.74,28.53 arc45 61.16,27.94 | D5.A 65,26.44 JP26.1 60.91,27.94 arc76 59.4,26.76 arc-76 57.65,25.4 SEWTAP4.1
  Bottom 0.305: SEWTAP4.1 50.04,21.85 46.1,21.85 43.3,24.65 U1.5
SEWTAP5
  Bottom 0.406: 61.16,27.94 arc-45 59.74,28.53 arc-45 58.42,31.71 58.42,32.43 arc-45 59.74,35.61 arc-45 61.16,36.2 63.5,36.2 | 53.59,25.4 57.65,25.4 arc76 59.4,26.76 arc-76 60.91,27.94 61.16,27.94 | 61.16,27.94 63.5,27.94
SEWTAP6
  Bottom 0.305: 60.15,16.9 60.01,16.76
  Bottom 0.406: 63.5,17.14 60.75,17.14 arc45 60.15,16.9 | 46.48,13.08 48.33,9.88 arc62 52.09,7.62 53.58,7.62 arc18 55.59,7.95 56.64,8.29 arc-18 60.3,8.89 60.9,8.89 | 63.5,8.89 60.9,8.89 | 60.9,8.89 arc-45 59.92,9.3 arc-45 58.42,12.92 arc-45 60.01,16.76
SEWTAP7
  Bottom 0.406: 25.15,25.4 17.46,25.4 arc-90 12.7,30.48 12.7,33.02
SEWTAP8
  Bottom 0.406: 32.26,13.08 30.2,9.51 arc-58 28.25,8.41 27.7,8.41 arc-52 24.75,9.85 arc52 21.48,11.43 17.4,11.43
SEWTAP+  (via drill 0.51)
  Top 0.406: v42.86,26.65 40.3,29.21 36.46,29.21 35.24,30.43 35.24,34.73 SEWTAP+.1 30,41.59 28.58,44.04 arc91 21.69,45.82 SEWTAPLS+.1 14.03,44.45 12.7,43.12 U3.C
  Bottom 0.305: U1.1 v42.86,26.65
SEWTAP+1
  Bottom 0.406: 19.3,44.45 21.69,45.82 arc-91 28.58,44.04 30,41.59 32.26,37.72
USB5V  (via drill 0.51)
  Top 0.406: JP2.1 49.21,31.11 46.35,31.11 v44.45,33.02
  Top 0.457: JP1.VBUS 38.07,37.51 37.78,37.23 37.78,35.56 38.42,34.92 42.55,34.92 v44.45,33.02
  Bottom 0.305: 47.62,33.02 | 45.72,33.02
  Bottom 0.406: R1.2 v44.45,33.02 45.72,33.02 47.62,33.02 | Q1.1 U2.3 45.72,33.02 | U2.1 47.62,33.02
USB_N  (via drill 0.51)
  Top 0.305: JP1.D- 38.73,38.42 v38.73,40.01
  Bottom 0.305: U1.21 39.12,28.47 37.22,30.38 37.22,37.25 39.14,39.17 39.13,39.63 v38.73,40.01
USB_P  (via drill 0.51)
  Top 0.305: JP1.D+ 39.37,39.37 v40.01,40.01
  Bottom 0.305: U1.22 39.62,28.68 37.72,30.58 37.72,37.04 39.61,38.97 39.61,39.57 v40.01,40.01
VDD  (via drill 0.51)
  Top 0.305: v33.34,22.86 38.73,17.46 44.13,17.46 46.67,20 v46.67,25.4
  Top 0.406: D1.4 24.1,20.09 v26.67,21.59
  Bottom 0.305: v26.67,21.59 27.94,22.86 v33.34,22.86 32.07,24.13 32.07,29.84 JP6.P$1 | 47.62,29.78 Q1.2 | U1.24 43.45,27.45 C4.1
  Bottom 0.406: Q1.2 47.62,28.26 | D2.C 48.9,28.57 48.58,28.26 47.62,28.26 | 47.62,28.26 47.62,26.35 v46.67,25.4 45.51,25.4 C4.1
X1
  Bottom 0.305: U1.7 Y1.P$2 C1.2
X2
  Bottom 0.305: U1.8 40.12,22.66 39.05,21.59 38.12,21.59 Y1.P$1 C2.2
(copper drawn outside any net)
  shapes: Top area x143, Top circle x1

### Text on the board
Bottom: V20 | V10 | V10
Dimension: ROUTE OUT | ROUTE OUT | ROUTE OUT | ROUTE OUT | ROUTE OUT | ROUTE OUT | ROUTE OUT | ROUTE OUT | ROUTE OUT | ROUTE OUT | ROUTE OUT | ROUTE OUT | ROUTE OUT | ROUTE OUT | ROUTE OUT | ROUTE OUT | ROUTE OUT | ROUTE OUT
tPlace: - | - | + | + | + | S | + | - | - | + | 1 | 4 | - | + | ON | CR2O32 | - | 2 | 3 | + | -
bPlace: - | + | + | - | + | S | White | - | VIN | LilyMini | 1 | + | 4 | White | - | SDA | TX | R 5 / G 6 / B 7 | + | White | 2 | 3 | - | SCL | RX | + | White | -
tNames: U3
bNames: D2 | U1
tDocu: GND | RED/SWDCLK | VDD | NC | RST | BLUE/SWDIO | BATT3V | NOTE 31 MIL / 0.8MM BOARD THICKNESS | M Grusin, A Sheehan